# EAGLE schematic LEDBox (EAGLE 9.1.3)
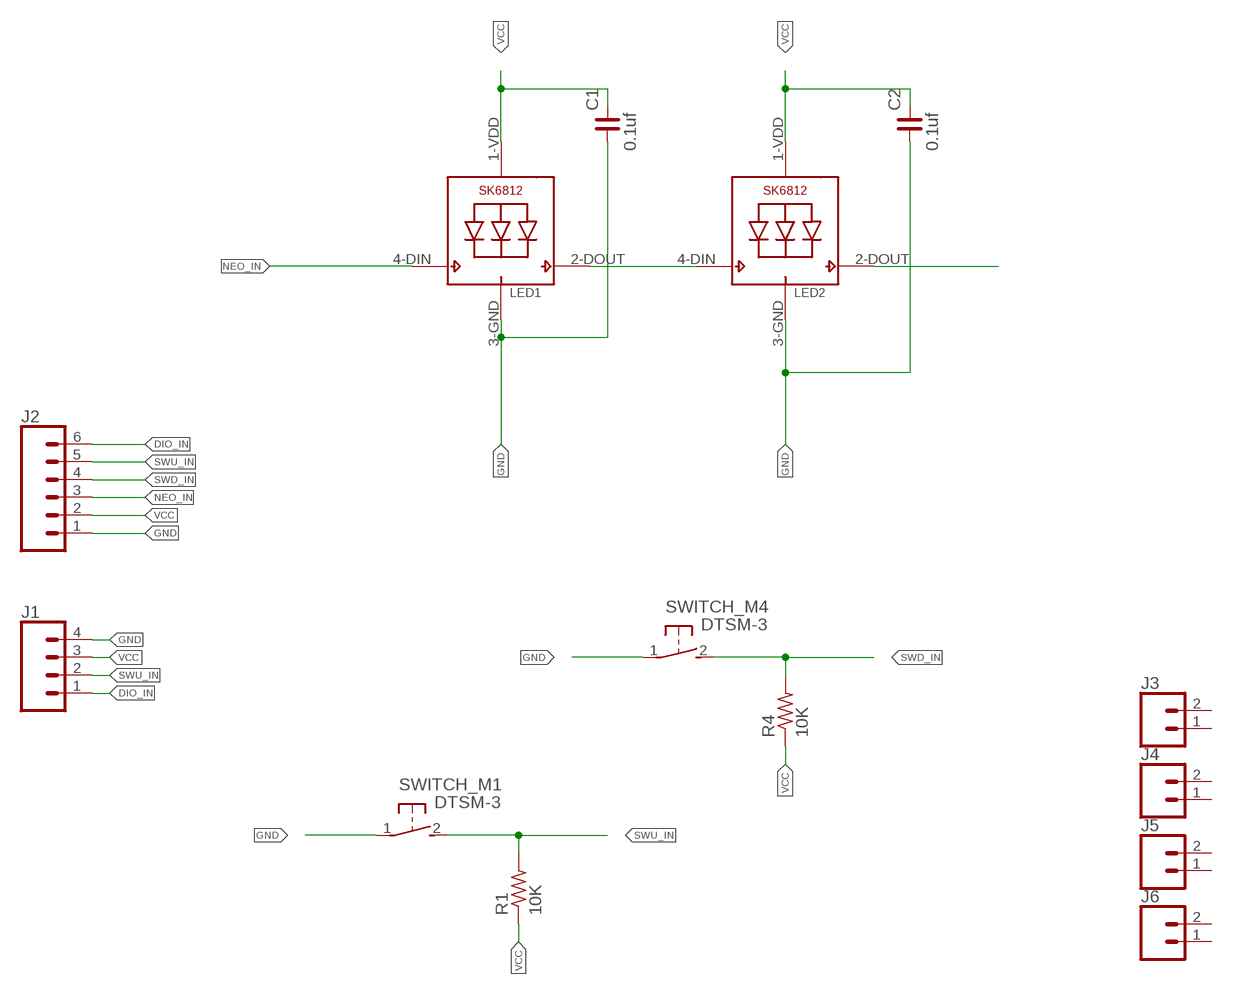
[diagram p0: schematic, sheet 1]

## Parts
C1  0.1uf  C_0805  [C0805]
C2  0.1uf  C_0805  [C0805]
J1  CONN_041X04_NO_SILK  [1X04_NO_SILK]
J2  CONN_06SMD-1MM  [1X06-1MM]
J3  CONN_02  [1X02]
J4  CONN_02  [1X02]
J5  CONN_02  [1X02]
J6  CONN_02  [1X02]
LED1  SK6812_5050  [LED5050]
LED2  SK6812_5050  [LED5050]
R1  10K  R-US_M0805  [M0805]
R4  10K  R-US_M0805  [M0805]
SWITCH_M1  DTSM-3  [DTSM-3]
SWITCH_M4  DTSM-3  [DTSM-3]

## Nets
DIO_IN: J1.1 J2.6
GND: C1.1 C2.1 J1.4 J2.1 LED1.3-GND(GND) LED2.3-GND(GND) SWITCH_M1.1 SWITCH_M4.1
N$1: LED1.2-DOUT(DO) LED2.4-DIN(DI)
N$2: LED2.2-DOUT(DO)
NEO_IN: J2.3 LED1.4-DIN(DI)
SWD_IN: J2.4 R4.2 SWITCH_M4.2
SWU_IN: J1.2 J2.5 R1.2 SWITCH_M1.2
VCC: C1.2 C2.2 J1.3 J2.2 LED1.1-VDD(VDD) LED2.1-VDD(VDD) R1.1 R4.1
Unconnected: J3.1 J3.2 J4.1 J4.2 J5.1 J5.2 J6.1 J6.2

## Library data of the parts
C1 C2 = rc-master-smd:C_: NON-POLARIZED CAP
J1 = SparkFun-Connectors:CONN_04: Multi connection point. Often used as Generic Header-pin footprint for 0.1 inch spaced/style header connections On any of the 0.1 inch spaced packages, you can populate with these: Break Away Headers - Straight <https://www.sparkfun.com/products/116> (PRT-00116) Break Away Male Headers - Right Angle <https://www.sparkfun.com/products/553> (PRT-00553) Female Headers <https://www.sparkfun.com/products/115> (PRT-00115) Break Away Headers - Machine Pin <https://www.sparkfun.com/products/117> (PRT-00117) Break Away Female Headers - Swiss Machine Pin <https://www.sparkfun.com/products/743> (PRT-00743) For SCREWTERMINALS and SPRING TERMINALS visit here: Screw Terimnals on SparkFun.com <https://www.sparkfun.com/search/results?term=Screw+Terminals> (5mm/3.5mm/2.54mm spacing) This device is also useful as a general connection point to wire up your design to another part of your project. Our various solder wires solder well into these plated through hole pads. Hook-Up Wire - Assortment (Stranded, 22 AWG) <https://www.sparkfun.com/products/11375> (PRT-11375) Hook-Up Wire - Assortment (Solid Core, 22 AWG) <https://www.sparkfun.com/products/11367> (PRT-11367) View the entire wire category on our website here <https://www.sparkfun.com/categories/141> Special notes: Molex polarized connector foot print use with SKU : PRT-08231 with associated crimp pins and housings. 1MM SMD Version SKU: PRT-10208; PROD_ID: CONN-09696
J2 = SparkFun-Connectors:CONN_06: Multi connection point. Often used as Generic Header-pin footprint for 0.1 inch spaced/style header connections On any of the 0.1 inch spaced packages, you can populate with these: Break Away Headers - Straight <https://www.sparkfun.com/products/116> (PRT-00116) Break Away Male Headers - Right Angle <https://www.sparkfun.com/products/553> (PRT-00553) Female Headers <https://www.sparkfun.com/products/115> (PRT-00115) Break Away Headers - Machine Pin <https://www.sparkfun.com/products/117> (PRT-00117) Break Away Female Headers - Swiss Machine Pin <https://www.sparkfun.com/products/743> (PRT-00743) Arduino Stackable Header - 6 Pin <https://www.sparkfun.com/products/9280> (PRT-09280) For SCREWTERMINALS and SPRING TERMINALS visit here: Screw Terimnals on SparkFun.com <https://www.sparkfun.com/search/results?term=Screw+Terminals> (5mm/3.5mm/2.54mm spacing) This device is also useful as a general connection point to wire up your design to another part of your project. Our various solder wires solder well into these plated through hole pads. Hook-Up Wire - Assortment (Stranded, 22 AWG) <https://www.sparkfun.com/products/11375> (PRT-11375) Hook-Up Wire - Assortment (Solid Core, 22 AWG) <https://www.sparkfun.com/products/11367> (PRT-11367) View the entire wire category on our website here <https://www.sparkfun.com/categories/141>; PROD_ID: CONN-08249; SF_ID: GPS-00579
J3-J6 = SparkFun-Connectors:CONN_02: Multi connection point. Often used as Generic Header-pin footprint for 0.1 inch spaced/style header connections On any of the 0.1 inch spaced packages, you can populate with these: Break Away Headers - Straight <https://www.sparkfun.com/products/116> (PRT-00116) Break Away Male Headers - Right Angle <https://www.sparkfun.com/products/553> (PRT-00553) Female Headers <https://www.sparkfun.com/products/115> (PRT-00115) Break Away Headers - Machine Pin <https://www.sparkfun.com/products/117> (PRT-00117) Break Away Female Headers - Swiss Machine Pin <https://www.sparkfun.com/products/743> (PRT-00743) For SCREWTERMINALS and SPRING TERMINALS visit here: Screw Terimnals on SparkFun.com <https://www.sparkfun.com/search/results?term=Screw+Terminals> (5mm/3.5mm/2.54mm spacing) This device is also useful as a general connection point to wire up your design to another part of your project. Our various solder wires solder well into these plated through hole pads. Hook-Up Wire - Assortment (Stranded, 22 AWG) <https://www.sparkfun.com/products/11375> (PRT-11375) Hook-Up Wire - Assortment (Solid Core, 22 AWG) <https://www.sparkfun.com/products/11367> (PRT-11367) View the entire wire category on our website here <https://www.sparkfun.com/categories/141> Special notes: Molex polarized connector foot print use with: PRT-08233 with associated crimp pins and housings. 2.54_SCREWTERM for use with PRT-10571. 3.5mm Screw Terminal footprints for PRT-08084 5mm Screw Terminal footprints for use with PRT-08432
LED1 LED2 = SK6812:SK6812
R1 R4 = resistor:R-US_: RESISTOR, American symbol
SWITCH_M1 SWITCH_M4 = switch-tact:DTSM-3

## Net classes
0 default: width 0.2 mm